# Altium project BTLNhung.PrjPcb
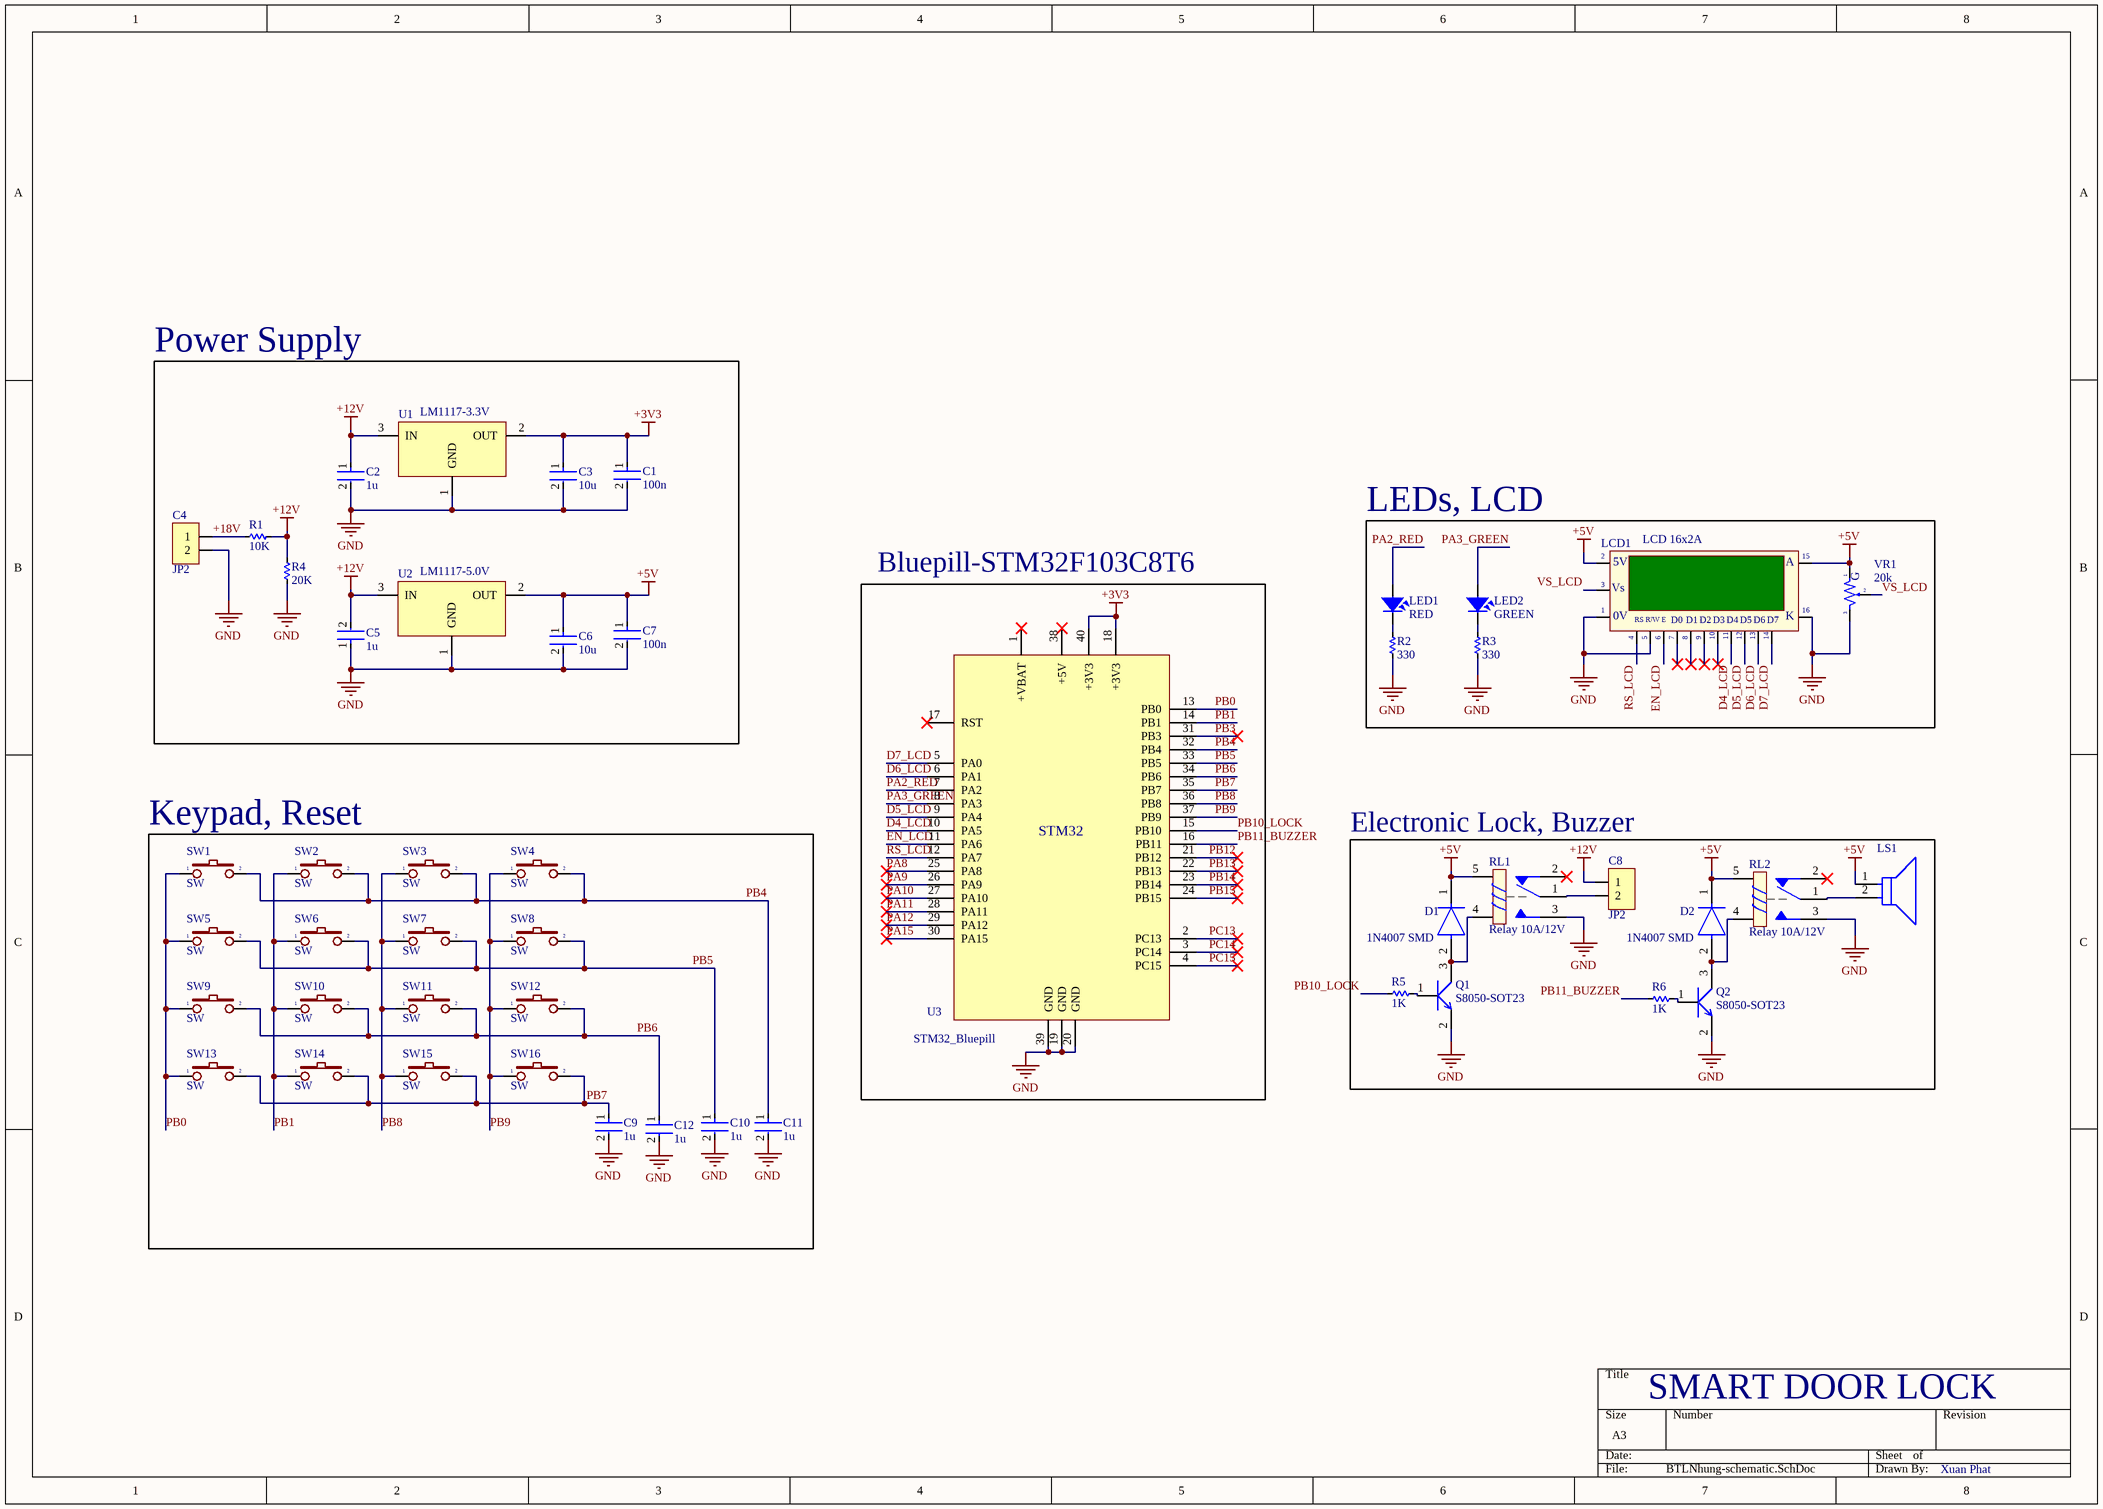
[diagram p0: BTLNhung-schematic.SchDoc]
1 sheet, 48 parts. Net scope: global (net labels, ports and power ports of the same name join across sheets).
Board file: PCB-1-Layrer.PcbDoc

## Sheet BTLNhung-schematic.SchDoc
size A3; SheetNumber: 1; SheetTotal: 1

### Parts
C1  100n  [FP-GRM188-0_1-e0_2_0_55-IPC_A]
C2  1u  [FP-GRM188-0_1-e0_2_0_55-IPC_A]
C3  10u  [FP-GRM188-0_1-e0_2_0_55-IPC_A]
C4  JP2  [JP2-D1C]
C5  1u  [FP-GRM188-0_1-e0_2_0_55-IPC_A]
C6  10u  [FP-GRM188-0_1-e0_2_0_55-IPC_A]
C7  100n  [FP-GRM188-0_1-e0_2_0_55-IPC_A]
C8  JP2  [JP2-D1C]
C9  1u  [FP-GRM188-0_1-e0_2_0_55-IPC_A]
C10  1u  [FP-GRM188-0_1-e0_2_0_55-IPC_A]
C11  1u  [FP-GRM188-0_1-e0_2_0_55-IPC_A]
C12  1u  [FP-GRM188-0_1-e0_2_0_55-IPC_A]
D1  1N4007 SMD  [FP-1N4007_SMD-IPC_C]
D2  1N4007 SMD  [FP-1N4007_SMD-IPC_C]
LCD1  LCD 16x2A  [LCD16X2]
LED1  RED  [LED-0805-Red]
LED2  GREEN  [LED-0805-Green]
LS1  AT-1224-TWT-5V-2-R  [FP-AT-1224-TWT-5V-2-R-MFG]  (value not drawn)
Q1  S8050-SOT23  [SOT95P240X115-3N]
Q2  S8050-SOT23  [SOT95P240X115-3N]
R1  10K  [RES-SMD-0805]
R2  330  [RES-SMD-0805]
R3  330  [RES-SMD-0805]
R4  20K  [RES-SMD-0805]
R5  1K  [RES-SMD-0805]
R6  1K  [RES-SMD-0805]
RL1  Relay 10A/12V  [Relay - SRA-05VDC-CL]
RL2  Relay 10A/12V  [Relay - SRA-05VDC-CL]
SW1  SW  [SW1-DIP-12x12x8-Black]
SW2  SW  [SW1-DIP-12x12x8-Black]
SW3  SW  [SW1-DIP-12x12x8-Black]
SW4  SW  [SW1-DIP-12x12x8-Black]
SW5  SW  [SW1-DIP-12x12x8-Black]
SW6  SW  [SW1-DIP-12x12x8-Black]
SW7  SW  [SW1-DIP-12x12x8-Black]
SW8  SW  [SW1-DIP-12x12x8-Black]
SW9  SW  [SW1-DIP-12x12x8-Black]
SW10  SW  [SW1-DIP-12x12x8-Black]
SW11  SW  [SW1-DIP-12x12x8-Black]
SW12  SW  [SW1-DIP-12x12x8-Black]
SW13  SW  [SW1-DIP-12x12x8-Black]
SW14  SW  [SW1-DIP-12x12x8-Black]
SW15  SW  [SW1-DIP-12x12x8-Black]
SW16  SW  [SW1-DIP-12x12x8-Black]
U1  LM1117-3.3V  [SOT223]
U2  LM1117-5.0V  [SOT223]
U3  STM32_Bluepill  [STM32F103_BluePill]
VR1  20k  [VR-S2]

### Blocks framed on the sheet
Power Supply: C1-C7 R1 R4 U1 U2
LEDs, LCD: LCD1 LED1 LED2 R2 R3 VR1
Bluepill-STM32F103C8T6: U3
Keypad, Reset: C9-C12 SW1-SW16
Electronic Lock, Buzzer: C8 D1 D2 LS1 Q1 Q2 R5 R6 RL1 RL2

### Nets
+3V3: C1.1 C3.1 U1.2(OUT) U3.18(+3V3) U3.40(+3V3)
+5V: C6.1 C7.1 D1.1(C) D2.1(C) LCD1.2(VDD) LCD1.15(A) LS1.1(C) RL1.5 RL2.5 U2.2(OUT) VR1.1
+12V: C2.1 C5.2 C8.1 R1.1 R4.1 U1.3(IN) U2.3(IN)
GND: C1.2 C2.2 C3.2 C4.2 C5.1 C6.2 C7.2 C9.2 C10.2 C11.2 C12.2 LCD1.1(GND) LCD1.5(R/~{W}) LCD1.16(K) Q1.2 Q2.2 R2.2 R3.2 R4.2 RL1.3 RL2.3 U1.1(GND) U2.1(GND) U3.19(GND) U3.20(GND) U3.39(GND) VR1.3
+18V: C4.1 R1.2
D4_LCD: LCD1.11(D4) U3.10(PA5)
D5_LCD: LCD1.12(D5) U3.9(PA4)
D6_LCD: LCD1.13(D6) U3.6(PA1)
D7_LCD: LCD1.14(D7) U3.5(PA0)
EN_LCD: LCD1.6(~{EN}) U3.11(PA6)
PA2_RED: LED1.1 U3.7(PA2)
PA3_GREEN: LED2.1 U3.8(PA3)
PA8: U3.25(PA8)
PA9: U3.26(PA9)
PA10: U3.27(PA10)
PA11: U3.28(PA11)
PA12: U3.29(PA12)
PA15: U3.30(PA15)
PB0: SW1.1 SW5.1 SW9.1 SW13.1 U3.13(PB0)
PB1: SW2.1 SW6.1 SW10.1 SW14.1 U3.14(PB1)
PB3: U3.31(PB3)
PB4: C11.1 SW1.2 SW2.2 SW3.2 SW4.2 U3.32(PB4)
PB5: C10.1 SW5.2 SW6.2 SW7.2 SW8.2 U3.33(PB5)
PB6: C12.1 SW9.2 SW10.2 SW11.2 SW12.2 U3.34(PB6)
PB7: C9.1 SW13.2 SW14.2 SW15.2 SW16.2 U3.35(PB7)
PB8: SW3.1 SW7.1 SW11.1 SW15.1 U3.36(PB8)
PB9: SW4.1 SW8.1 SW12.1 SW16.1 U3.37(PB9)
PB10_LOCK: R5.2 U3.15(PB10)
PB11_BUZZER: R6.2 U3.16(PB11)
PB12: U3.21(PB12)
PB13: U3.22(PB13)
PB14: U3.23(PB14)
PB15: U3.24(PB15)
PC13: U3.2(PC13)
PC14: U3.3(PC14)
PC15: U3.4(PC15)
RS_LCD: LCD1.4(RS) U3.12(PA7)
VS_LCD: LCD1.3(VEE) VR1.2
NetC8_2: C8.2 RL1.1
NetD1_2: D1.2(A) Q1.3 RL1.4
NetD2_2: D2.2(A) Q2.3 RL2.4
NetLED1_2: LED1.2 R2.1
NetLED2_2: LED2.2 R3.1
NetLS1_2: LS1.2(A) RL2.1
NetQ1_1: Q1.1 R5.1
NetQ2_1: Q2.1 R6.1

Not connected (* = marked no-connect by the designer): LCD1 7(D0)* 8(D1)* 9(D2)* 10(D3)*; RL1 2*; RL2 2*; U3 1(+VBAT)* 17(RST)* 38(+5V)*

### Notes on the sheet
- SMART DOOR LOCK
- Xuan Phat
- (in symbol LCD16x2A) 5V; Vs; |; 0V; R/W; E
- (in symbol STM32_Bluepill) STM32
- (in symbol VR-S) G

### Library data of the parts
C1-C3 C5-C7 C9-C12 = CMP-2006-02792-2: Chip Multilayer Ceramic Capacitors for General Purpose, 0603, 10uF, X5R, 15%, 20%, 6.3V; Packaging: Tape and Reel; Voltage Rating (DC): 6.3V; Width: 0.031inch; Termination: SMD/SMT; Dielectric: X5R; Package Quantity: 4000; Voltage Rating: 6.3V; Capacitance: 10uF; Case/Package: 0603; Min Operating Temperature: -55°C; Voltage: 6.3V; Length: 1.6mm; Thickness: 0.035inch; Lead Free: Lead Free; Depth: 0.8mm; Case Code (Imperial): 0603; Max Operating Temperature: 85°C; Material: Ceramic; Height: 0.8mm; Tolerance: 20%; Mount: Surface Mount; REACH SVHC: No SVHC; Radiation Hardening: No; Case Code (Metric): 1608
C4 C8 = JP2: WR-PHD 2.54 mm Angled Socket Header; Manufacturer: W¨¹rth Elektronik eiSos GmbH; partNo: 613002143121; ComponentLink1 Description: Manufacturer; ComponentLink2 Description: Datasheet; NoPins: 02; Created Date: 29 March 2013; ComponentLink1URL: http://www.we-online.com; ComponentLink2URL: http://katalog.we-online.de/em/datasheet/6130xx143121.pdf; Created by: Karrer Zheng
D1 D2 = CMP-12389-000001-1: Rectifier, 1Kv, 1A, Do-214Ac Rohs Compliant: Yes
LCD1 = LCD16x2A: LCD dipslay 16 char, 2 line; Value: LCD16x2A
LED1 LED2 = LED SMD: Value: LED 3 - 5 ly 2 Colour
LS1 = CMP-231722-000001-1: BUZZER MAGNETIC 5V 12MM TH; Operating Supply Current: 40mA; Frequency: 2.4kHz; Min Operating Temperature: -30°C; Voltage Rating: 5V; Mount: Through Hole; Diameter: 12mm; Termination: PC Pins; Max Operating Temperature: 70°C; Contact Plating: Tin; Height: 9mm; Series: AT; Max Supply Current: 40mA; Sensing Method: Magnetic; Packaging: Tray
Q1 Q2 = S8050-SOT23: S8050 J3Y Transistor NPN 25V 0.5A 3 Pins SOT-23
R1-R6 = Res-SMD: Resistor; Manufacturer: Generic Components; Class: Passive; Published: 08/06/2000; Publisher: Altium Hobart Technology Centre
RL1 RL2 = Relay 5: Relay SPDT,10A - 12VDC 5 Pin; Value: Relay SPDT, 10A, 12V
SW1-SW16 = SW2: Switch button 2 pin; Value: SW chip 2 pin
U1 U2 = LM1117: 800mA Low-Dropout Linear Regulator; Creator: Nguyen Ba Bien; Website: http://group3i.net
VR1 = VR-S: Var Resistor; Value: Volume 50k